# EAGLE design main (EAGLE 7.1.0)
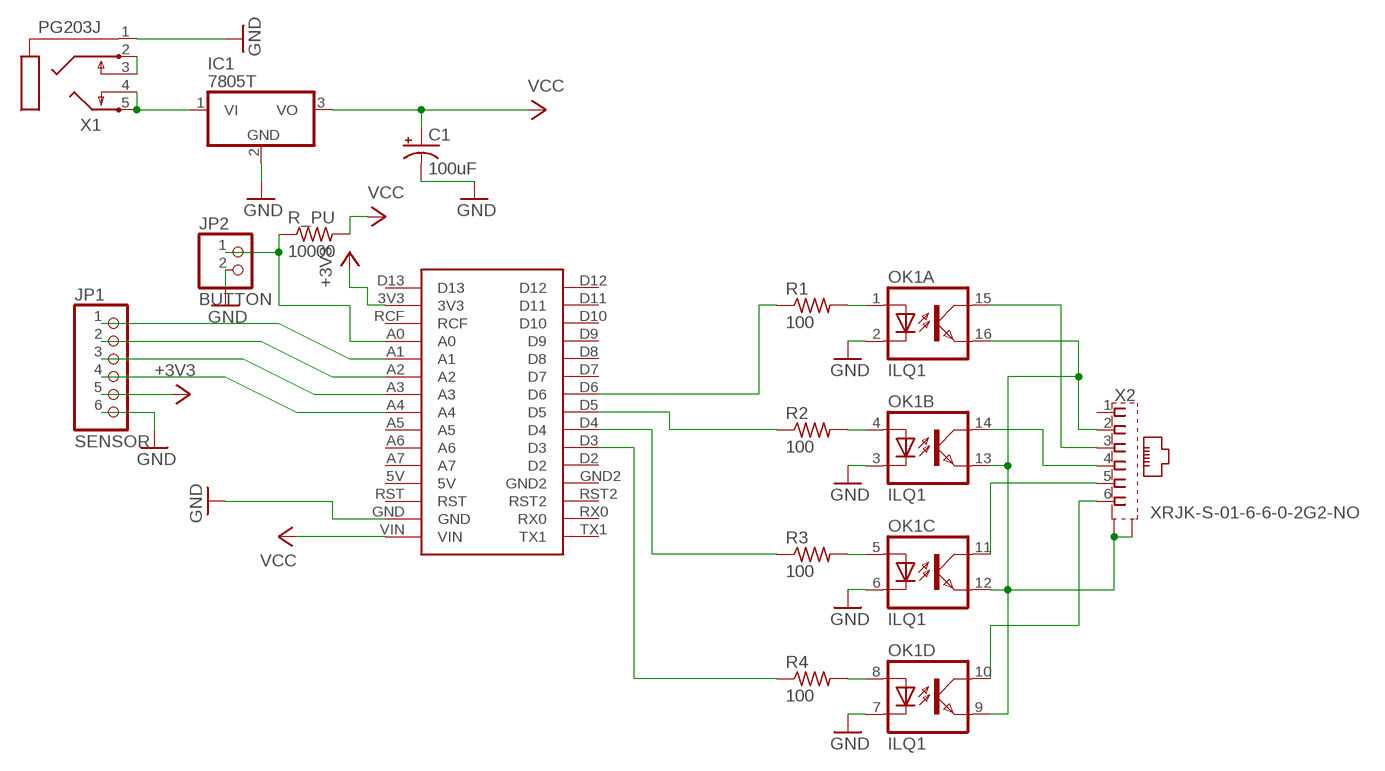
[diagram p0: schematic, sheet 1]

## Parts
C1  100uF  CPOL-USE2,5-6E  [E2,5-6E]
IC1  7805T  [TO220H]
JP1  SENSOR  PINHD-1X6  [1X06]
JP2  BUTTON  PINHD-1X2  [1X02]
OK1  ILQ1  [DIL16]
R1  100  R-US_0207/7  [0207/7]
R2  100  R-US_0207/7  [0207/7]
R3  100  R-US_0207/7  [0207/7]
R4  100  R-US_0207/7  [0207/7]
R_PU  10000  R-US_0207/7  [0207/7]
U$1  ARDUINO_NANO_DEV  [NANO_PACK]
X1  PG203J  [PG203J]
X2  XRJK-S-01-6-6-0-2G2-NO  [XRJK-S-01-6-6-0-2G2-NO]

## Nets
+3V3: JP1.5 U$1.3V3
GND: C1.- IC1.2(GND) JP1.6 JP2.2 OK1.2(A:C) OK1.3(B:C) OK1.6(C:C) OK1.7(D:C) U$1.GND X1.1
N$1: OK1.1(A:A) R1.2
N$2: OK1.4(B:A) R2.2
N$3: OK1.5(C:A) R3.2
N$4: OK1.8(D:A) R4.2
N$5: OK1.10(D:COL) X2.6
N$6: OK1.11(C:COL) X2.5
N$7: OK1.14(B:COL) X2.4
N$8: OK1.15(A:COL) X2.3
N$9: OK1.9(D:EMIT) OK1.12(C:EMIT) OK1.13(B:EMIT) OK1.16(A:EMIT) X2.2 X2.S1(S) X2.S2(S)
N$10: JP1.1 U$1.A1
N$11: JP1.2 U$1.A2
N$12: JP1.3 U$1.A3
N$13: JP1.4 U$1.A4
N$14: IC1.1(VI) X1.4 X1.5
N$15: JP2.1 R_PU.1 U$1.A0
N$16: R4.1 U$1.D3
N$17: R3.1 U$1.D4
N$18: R2.1 U$1.D5
N$19: R1.1 U$1.D6
N$20: X1.2 X1.3
VCC: C1.+ IC1.3(VO) R_PU.2 U$1.VIN
Unconnected: U$1.5V U$1.A5 U$1.A6 U$1.A7 U$1.D2 U$1.D7 U$1.D8 U$1.D9 U$1.D10 U$1.D11 U$1.D12 U$1.D13 U$1.GND2 U$1.RCF U$1.RST U$1.RST2 U$1.RX0 U$1.TX1 X2.1

## Library data of the parts
C1 = adafruit:CPOL-US: POLARIZED CAPACITOR, American symbol; OC_NEWARK: unknown
IC1 = adafruit:78*: Positive VOLTAGE REGULATOR Added bigger pads to the TO-92 package; MPN: LM7805CT; OC_NEWARK: 34C1092
JP1 = pinhead:PINHD-1X6: PIN HEADER; OC_NEWARK: unknown
JP2 = pinhead:PINHD-1X2: PIN HEADER; OC_NEWARK: unknown
OK1 = optocoupler:ILQ1: SIEMENS OPTO COUPLER; MF: VISHAY/TELEFUNKEN; MPN: ILQ1; OC_FARNELL: 1469501; OC_NEWARK: 88K1954
R1-R4 R_PU = resistor:R-US_: RESISTOR, American symbol; OC_NEWARK: unknown
U$1 = Arduini_Nano:ARDUINO_NANO_DEV; OC_NEWARK: unknown
X1 = con-hirschmann:PG203J: MIC/HEADPHONE JACK KS-S stereo microphone/headphone jack PG203JN (Schukat); OC_FARNELL: unknown; OC_NEWARK: unknown
X2 = con-xmultiple:XRJK*6: RJ11 Connector without LED, 6 position, 6 contacts, shielded, thrue hole Source: XRJK-S-01-6-6-0-2G2-NO(01).pdf; OC_NEWARK: unknown

## Net classes
0 default: width 0.508 mm, drill 1.016 mm, clearance 0.762 mm

## Board
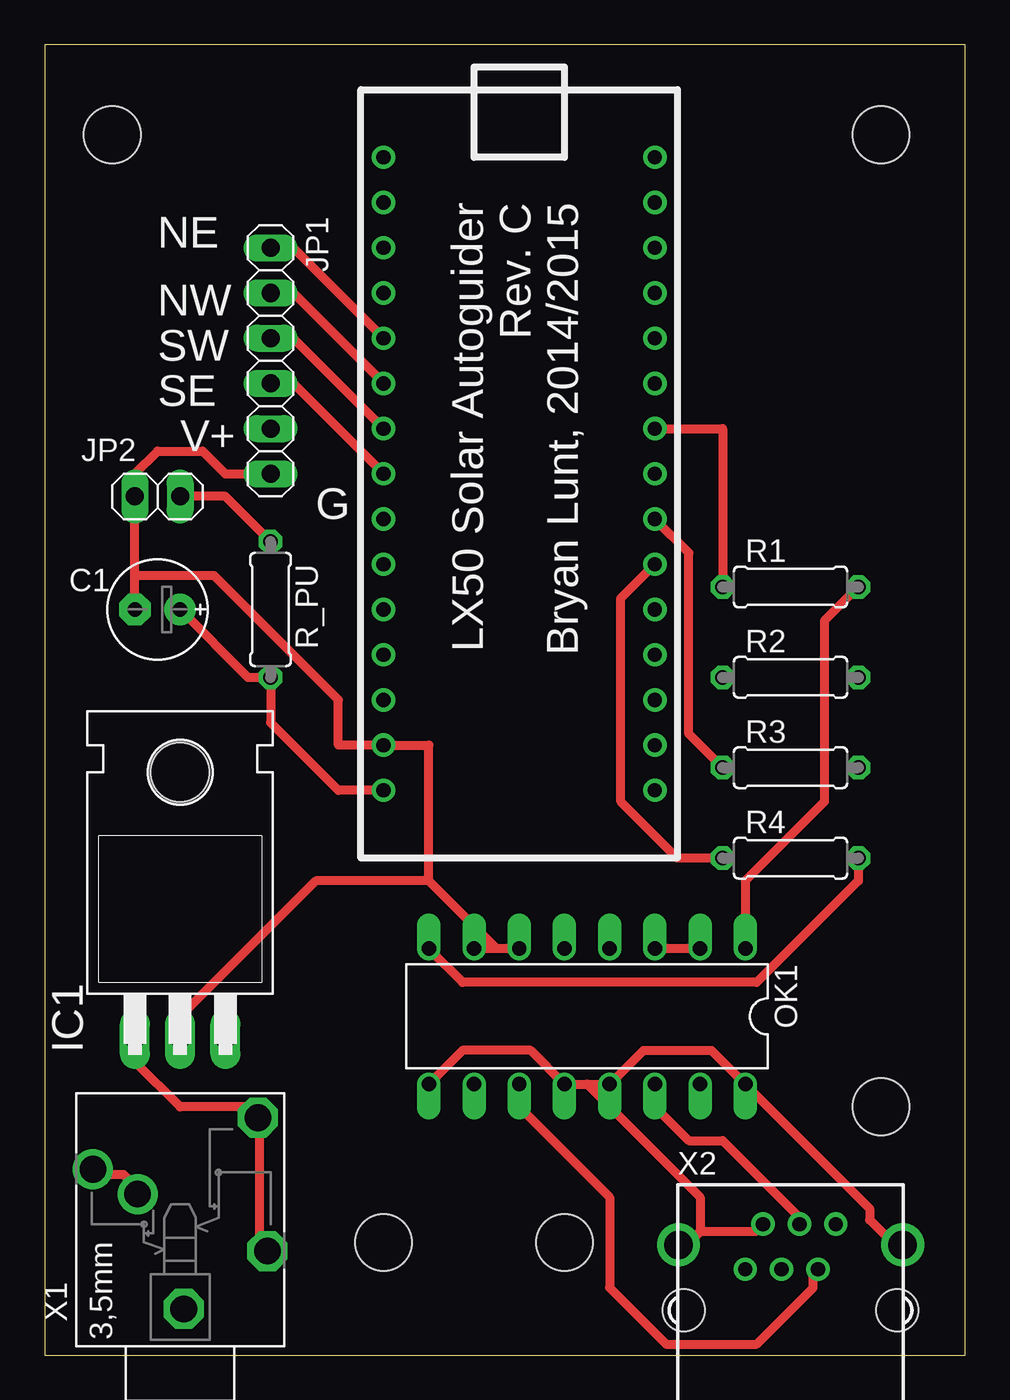
[diagram p1: board, top side]
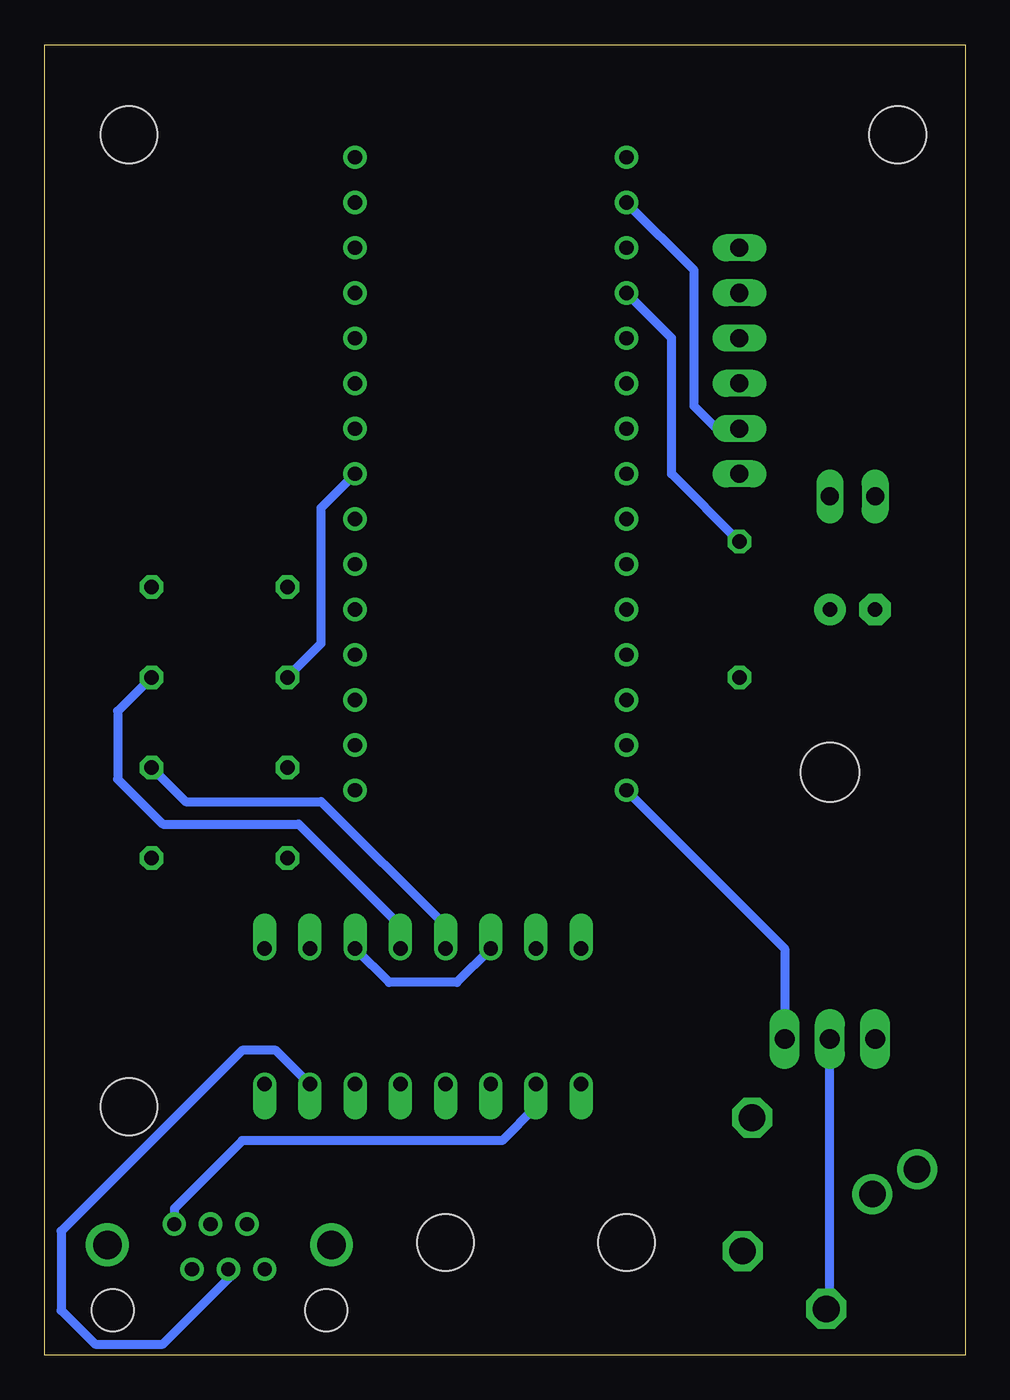
[diagram p2: board, bottom side, seen from below]

Size 51.74 x 73.65 mm. Coordinates in mm from the lower left corner, seen from the top.
Outline: 0,0 51.74,0 51.74,73.65 0,73.65 0,0
Copper layers (1*16): Top 0.035mm / dielectric 1.5mm / Bottom 0.035mm
Design rules "dirt_cheap_dirty_boards.v1": minimum track width 5mil, minimum drill 12mil, track to track 5mil, track to pad 5mil, pad to pad 5mil, via to via 5mil, smd to smd 0mil, copper to edge 10mil, drill to drill 10mil, minimum pad ring 10mil, minimum via ring 6mil, stop-mask expansion 2mil, vias tented up to drill 25mil, thermal gap 10mil
Holes 3.2 mm at 3.81,68.58 46.99,68.58 46.99,13.97 19.05,6.35 29.21,6.35

### Footprints (pad centres in the part's own frame; a part is rotated, then mirrored left to right if it is on the bottom)
E2,5-6E = drill 0.813 pad 1.778: + -1.27,0 | drill 0.813 pad 1.778 octagon: - 1.27,0
TO220H = drill 1.118 long: 1 -2.54,-10.16; 2 0,-10.16; 3 2.54,-10.16 | hole 3.302: 0,4.826
1X06 = drill 1.016 long: 1 -6.35,0; 2 -3.81,0; 3 -1.27,0; 4 1.27,0; 5 3.81,0; 6 6.35,0
1X02 = drill 1.016 long: 1 -1.27,0; 2 1.27,0
DIL16 = drill 0.813 offset: 1 -8.89,-3.81; 2 -6.35,-3.81; 3 -3.81,-3.81; 4 -1.27,-3.81; 5 1.27,-3.81; 6 3.81,-3.81; 7 6.35,-3.81; 8 8.89,-3.81; 9 8.89,3.81; 10 6.35,3.81; 11 3.81,3.81; 12 1.27,3.81; 13 -1.27,3.81; 14 -3.81,3.81; 15 -6.35,3.81; 16 -8.89,3.81
0207/7 = drill 0.813 octagon: 1 -3.81,0; 2 3.81,0
NANO_PACK = drill 0.8: 3V3 7.62,-15.24; 5V 7.62,10.16; A0 7.62,-10.16; A1 7.62,-7.62; A2 7.62,-5.08; A3 7.62,-2.54; A4 7.62,0; A5 7.62,2.54; A6 7.62,5.08; A7 7.62,7.62; D2 -7.62,7.62; D3 -7.62,5.08; D4 -7.62,2.54; D5 -7.62,0; D6 -7.62,-2.54; D7 -7.62,-5.08; D8 -7.62,-7.62; D9 -7.62,-10.16; D10 -7.62,-12.7; D11 -7.62,-15.24; D12 -7.62,-17.78; D13 7.62,-17.78; GND 7.62,15.24; GND2 -7.62,10.16; RCF 7.62,-12.7; RST 7.62,12.7; RST2 -7.62,12.7; RX0 -7.62,15.24; TX1 -7.62,17.78; VIN 7.62,17.78
PG203J = drill 1.499 octagon: 1 -5.004,-0.203; 4 5.74,-4.369; 5 -1.753,-4.902 | drill 1.499: 2 2.845,4.902; 3 1.448,2.388
YH-55-10 = drill 0.8 pad 1.3: 1 -2.54,2.3; 2 -1.54,4.84; 3 -0.5,2.3; 4 0.5,4.84; 5 1.54,2.3; 6 2.54,4.84 | drill 1.6 pad 2.184: S1 -6.3,3.68; S2 6.3,3.68 | hole 2.36: -6,0; 6,0

### Placement (x,y rotation side)
C1  6.35,41.91 180 top
IC1  7.62,27.94 0 top
JP1  12.7,55.88 270 top
JP2  6.35,48.26 180 top
OK1  30.48,19.05 180 top
R1  41.91,43.18 0 top
R2  41.91,38.1 0 top
R3  41.91,33.02 0 top
R4  41.91,27.94 0 top
R_PU  12.7,41.91 270 top
U$1  26.67,49.53 180 top
X1  7.62,7.62 90 top
X2  YH-55-10  [YH-55-10]  41.91,2.54 0 top

### Tracks (layer width: path | path; a pad name or v marks a point on that pad's centre or on a via)
+3V3
  Bottom 0.508: U$1.3V3 15.24,60.96 15.24,53.34 13.97,52.07 JP1.5
GND
  Top 0.508: C1.- 5.08,43.81 | 5.08,43.81 JP2.2 5.08,49.53 6.35,50.8 8.89,50.8 10.16,49.53 JP1.6 | OK1.2 OK1.3 | OK1.6 25.4,22.86 | 25.4,22.86 OK1.7 | 21.59,26.67 21.59,34.29 U$1.GND 16.51,34.29 16.51,36.83 9.53,43.81 5.08,43.81 | 25.4,22.86 21.59,26.67 | IC1.2 7.62,19.05 15.24,26.67 21.59,26.67
  Bottom 0.508: IC1.2 7.62,3.17 X1.1 | OK1.3 32.38,20.95 28.57,20.95 OK1.6
N$1
  Top 0.508: OK1.1 39.37,26.67 43.81,31.11 43.81,41.27 R1.2
N$2
  Bottom 0.508: OK1.4 31.75,24.13 37.47,29.84 45.09,29.84 47.62,32.38 47.62,36.2 R2.2
N$3
  Bottom 0.508: OK1.5 29.21,24.13 36.2,31.11 43.81,31.11 R3.2
N$4
  Top 0.508: OK1.8 23.5,20.95 40.01,20.95 45.72,26.67 R4.2
N$5
  Bottom 0.508: X2.6 44.45,8.26 40.64,12.06 26.04,12.06 24.13,13.97 OK1.10
N$6
  Top 0.508: OK1.11 26.67,13.97 31.75,8.89 31.75,3.81 34.92,0.64 40.01,0.64 43.18,3.81 43.18,4.45 X2.5
N$7
  Top 0.508: OK1.14 34.29,13.97 36.2,12.06 38.1,12.06 42.55,7.62 X2.4
N$8
  Bottom 0.508: OK1.15 38.73,17.14 40.64,17.14 50.8,6.99 50.8,2.54 48.9,0.64 45.09,0.64 41.27,4.45 X2.3
N$9
  Top 0.508: 36.83,6.99 40.01,6.99 X2.2 | 36.83,6.99 36.2,6.35 X2.S1 | OK1.9 23.5,17.14 27.3,17.14 OK1.12 30.48,15.24 | 30.48,15.24 OK1.13 33.66,17.14 37.47,17.14 OK1.16 46.35,8.26 46.35,7.62 47.62,6.35 X2.S2 | 36.83,6.99 36.83,8.89 30.48,15.24
N$10
  Top 0.508: U$1.A1 13.97,62.23 JP1.1
N$11
  Top 0.508: U$1.A2 13.97,59.69 JP1.2
N$12
  Top 0.508: U$1.A3 13.97,57.15 JP1.3
N$13
  Top 0.508: U$1.A4 13.97,54.61 JP1.4
N$14
  Top 0.508: IC1.1 5.08,16.51 7.62,13.97 11.43,13.97 X1.4 12.06,13.34 12.06,6.35 X1.5
N$15
  Top 0.508: JP2.1 10.16,48.26 R_PU.1
  Bottom 0.508: U$1.A0 16.51,57.15 16.51,49.53 R_PU.1
N$16
  Top 0.508: U$1.D3 32.38,42.55 32.38,31.11 35.56,27.94 R4.1
N$17
  Top 0.508: U$1.D4 36.2,45.09 36.2,34.92 R3.1
N$18
  Bottom 0.508: U$1.D5 36.2,47.62 36.2,40.01 R2.1
N$19
  Top 0.508: U$1.D6 38.1,52.07 R1.1
N$20
  Top 0.508: X1.2 3.17,10.16 4.45,10.16 5.08,9.53 X1.3
VCC
  Top 0.508: U$1.VIN 16.51,31.75 12.7,35.56 R_PU.2 11.43,38.1 C1.+
  Bottom 0.508: IC1.3 10.16,22.86 U$1.VIN

### Text on the board
tPlace: LX50 Solar Autoguider / Rev. C / Bryan Lunt, 2014/2015 | NE | NW | SW | SE | V+ | G